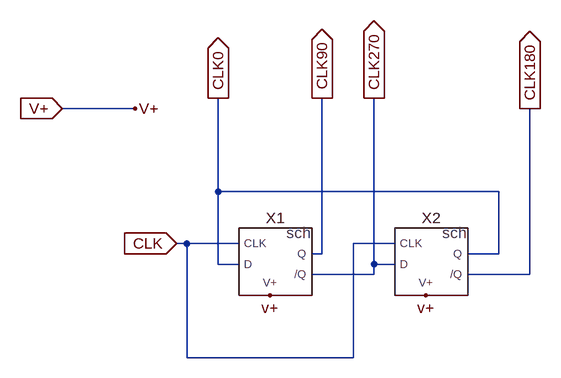
[diagram p0: schematic QuadGen.asc]
QuadGen.asc, the LTspice schematic file:
Version 4
SHEET 1 964 680
WIRE -16 96 -128 96
WIRE 112 224 112 80
WIRE 544 224 112 224
WIRE 64 304 48 304
WIRE 144 304 64 304
WIRE 384 304 320 304
WIRE 272 320 272 80
WIRE 272 320 256 320
WIRE 544 320 544 224
WIRE 544 320 496 320
WIRE 112 336 112 224
WIRE 144 336 112 336
WIRE 352 336 352 80
WIRE 384 336 352 336
WIRE 352 352 352 336
WIRE 352 352 256 352
WIRE 592 352 592 96
WIRE 592 352 496 352
WIRE 64 480 64 304
WIRE 320 480 320 304
WIRE 320 480 64 480
FLAG 48 304 CLK
IOPIN 48 304 In
FLAG 272 80 CLK90
IOPIN 272 80 Out
FLAG 352 80 CLK270
IOPIN 352 80 Out
FLAG 112 80 CLK0
IOPIN 112 80 Out
FLAG 592 96 CLK180
IOPIN 592 96 Out
FLAG 192 384 v+
FLAG 432 384 v+
FLAG -16 96 V+
FLAG -128 96 V+
IOPIN -128 96 In
SYMBOL D-FlipFlop-Edge 192 336 R0
SYMATTR InstName X1
SYMBOL D-FlipFlop-Edge 432 336 R0
SYMATTR InstName X2

The netlist it stands for:
* QuadGen.asc
XX1 CLK CLK0 v+ CLK270 CLK90 D-FlipFlop-Edge  ; pins CLK D V+ /Q Q
XX2 CLK CLK270 v+ CLK180 CLK0 D-FlipFlop-Edge  ; pins CLK D V+ /Q Q
.backanno
.end